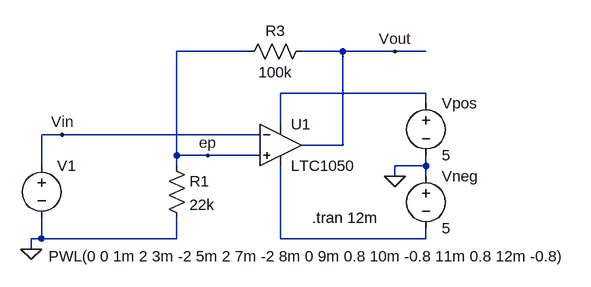
[diagram p0: schematic schmitt.asc]
schmitt.asc, the LTspice schematic file:
Version 4
SHEET 1 880 680
WIRE 176 48 64 48
WIRE 320 48 256 48
WIRE 400 48 320 48
WIRE 448 48 400 48
WIRE 448 112 224 112
WIRE 448 128 448 112
WIRE 224 160 224 112
WIRE -112 176 -144 176
WIRE 192 176 -112 176
WIRE 320 192 320 48
WIRE 320 192 256 192
WIRE 64 208 64 48
WIRE 112 208 64 208
WIRE 192 208 112 208
WIRE -144 224 -144 176
WIRE 64 224 64 208
WIRE 448 224 448 208
WIRE 448 224 400 224
WIRE 400 240 400 224
WIRE 448 240 448 224
WIRE -144 336 -144 304
WIRE -144 336 -160 336
WIRE 64 336 64 304
WIRE 64 336 -144 336
WIRE 224 336 224 224
WIRE 448 336 448 320
WIRE 448 336 224 336
WIRE -160 352 -160 336
FLAG 400 240 0
FLAG 400 48 Vout
FLAG 112 208 ep
FLAG -112 176 Vin
FLAG -160 352 0
SYMBOL Opamps\\LTC1050 224 128 R0
SYMATTR InstName U1
SYMBOL res 272 32 R90
WINDOW 0 0 56 VBottom 2
WINDOW 3 32 56 VTop 2
SYMATTR InstName R3
SYMATTR Value 100k
SYMBOL voltage 448 112 R0
SYMATTR InstName Vpos
SYMATTR Value 5
SYMBOL voltage 448 224 R0
SYMATTR InstName Vneg
SYMATTR Value 5
SYMBOL voltage -144 208 R0
WINDOW 123 0 0 Left 2
WINDOW 39 0 0 Left 2
WINDOW 3 11 155 Left 2
SYMATTR InstName V1
SYMATTR Value PWL(0 0 1m 2 3m -2 5m 2 7m -2 8m 0 9m 0.8 10m -0.8 11m 0.8 12m -0.8)
SYMBOL res 48 208 R0
SYMATTR InstName R1
SYMATTR Value 22k
TEXT 272 304 Left 2 !.tran 12m

The netlist it stands for:
* schmitt.asc
XU1 ep Vin N001 N002 Vout LTC1050  ; pins In+ In- V+ V- OUT
R3 Vout ep 100k
Vpos N001 0 5
Vneg 0 N002 5
V1 Vin 0 PWL(0 0 1m 2 3m -2 5m 2 7m -2 8m 0 9m 0.8 10m -0.8 11m 0.8 12m -0.8)
R1 ep 0 22k
.tran 12m
.lib LTC.lib
.backanno
.end